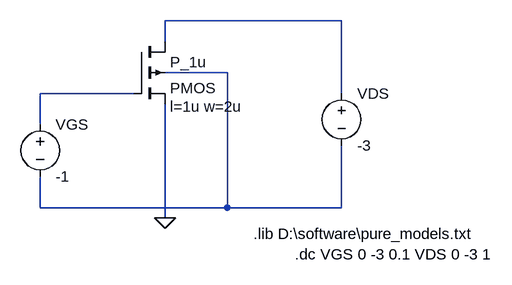
[diagram p0: schematic PMOS long channel.asc]
PMOS long channel.asc, the LTspice schematic file:
Version 4
SHEET 1 880 680
WIRE 416 64 144 64
WIRE 144 96 144 64
WIRE 240 144 144 144
WIRE 96 176 -48 176
WIRE 416 176 416 64
WIRE -48 224 -48 176
WIRE -48 352 -48 304
WIRE 240 352 240 144
WIRE 240 352 -48 352
WIRE 416 352 416 256
WIRE 416 352 240 352
WIRE 144 368 144 192
FLAG 144 368 0
SYMBOL pmos4 96 96 R0
WINDOW 123 56 100 Left 2
SYMATTR Value2 l=1u w=2u
SYMATTR InstName P_1u
SYMBOL voltage 416 160 R0
WINDOW 123 0 0 Left 0
WINDOW 39 0 0 Left 0
SYMATTR InstName VDS
SYMATTR Value -3
SYMBOL voltage -48 208 R0
WINDOW 123 0 0 Left 0
WINDOW 39 0 0 Left 0
SYMATTR InstName VGS
SYMATTR Value -1
TEXT 280 392 Left 2 !.lib D:\\software\\pure_models.txt
TEXT 344 424 Left 2 !.dc VGS 0 -3 0.1 VDS 0 -3 1

The netlist it stands for:
* PMOS long channel.asc
M§P_1u N001 N003 0 N002 PMOS l=1u w=2u
VDS N001 N002 -3
VGS N003 N002 -1
.model NMOS NMOS
.model PMOS PMOS
.lib standard.mos
.lib D:\software\pure_models.txt
.dc VGS 0 -3 0.1 VDS 0 -3 1
.backanno
.end